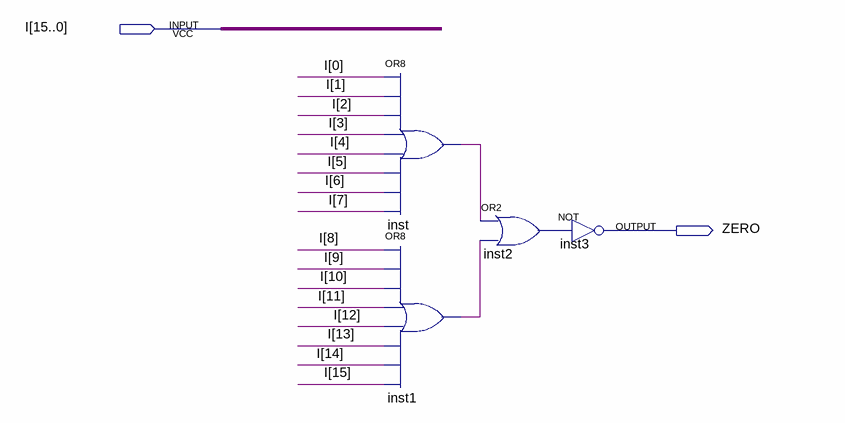
[diagram p0: schematic sheet]
// Quartus schematic ZERO.bdf as structural Verilog: 4 symbols, 2 pins
module ZERO (
  input  [15:0] I,
  output ZERO
);

  wire inst1_out, inst2_out, inst_out;

  or inst (inst_out, I[0], I[1], I[2], I[3], I[4], I[5], I[6], I[7]);
  or inst1 (inst1_out, I[8], I[9], I[10], I[11], I[12], I[13], I[14], I[15]);
  or inst2 (inst2_out, inst_out, inst1_out);
  not inst3 (ZERO, inst2_out);
endmodule
